# EAGLE design e-socks (EAGLE 6.4)

## Sheet 1 of 4
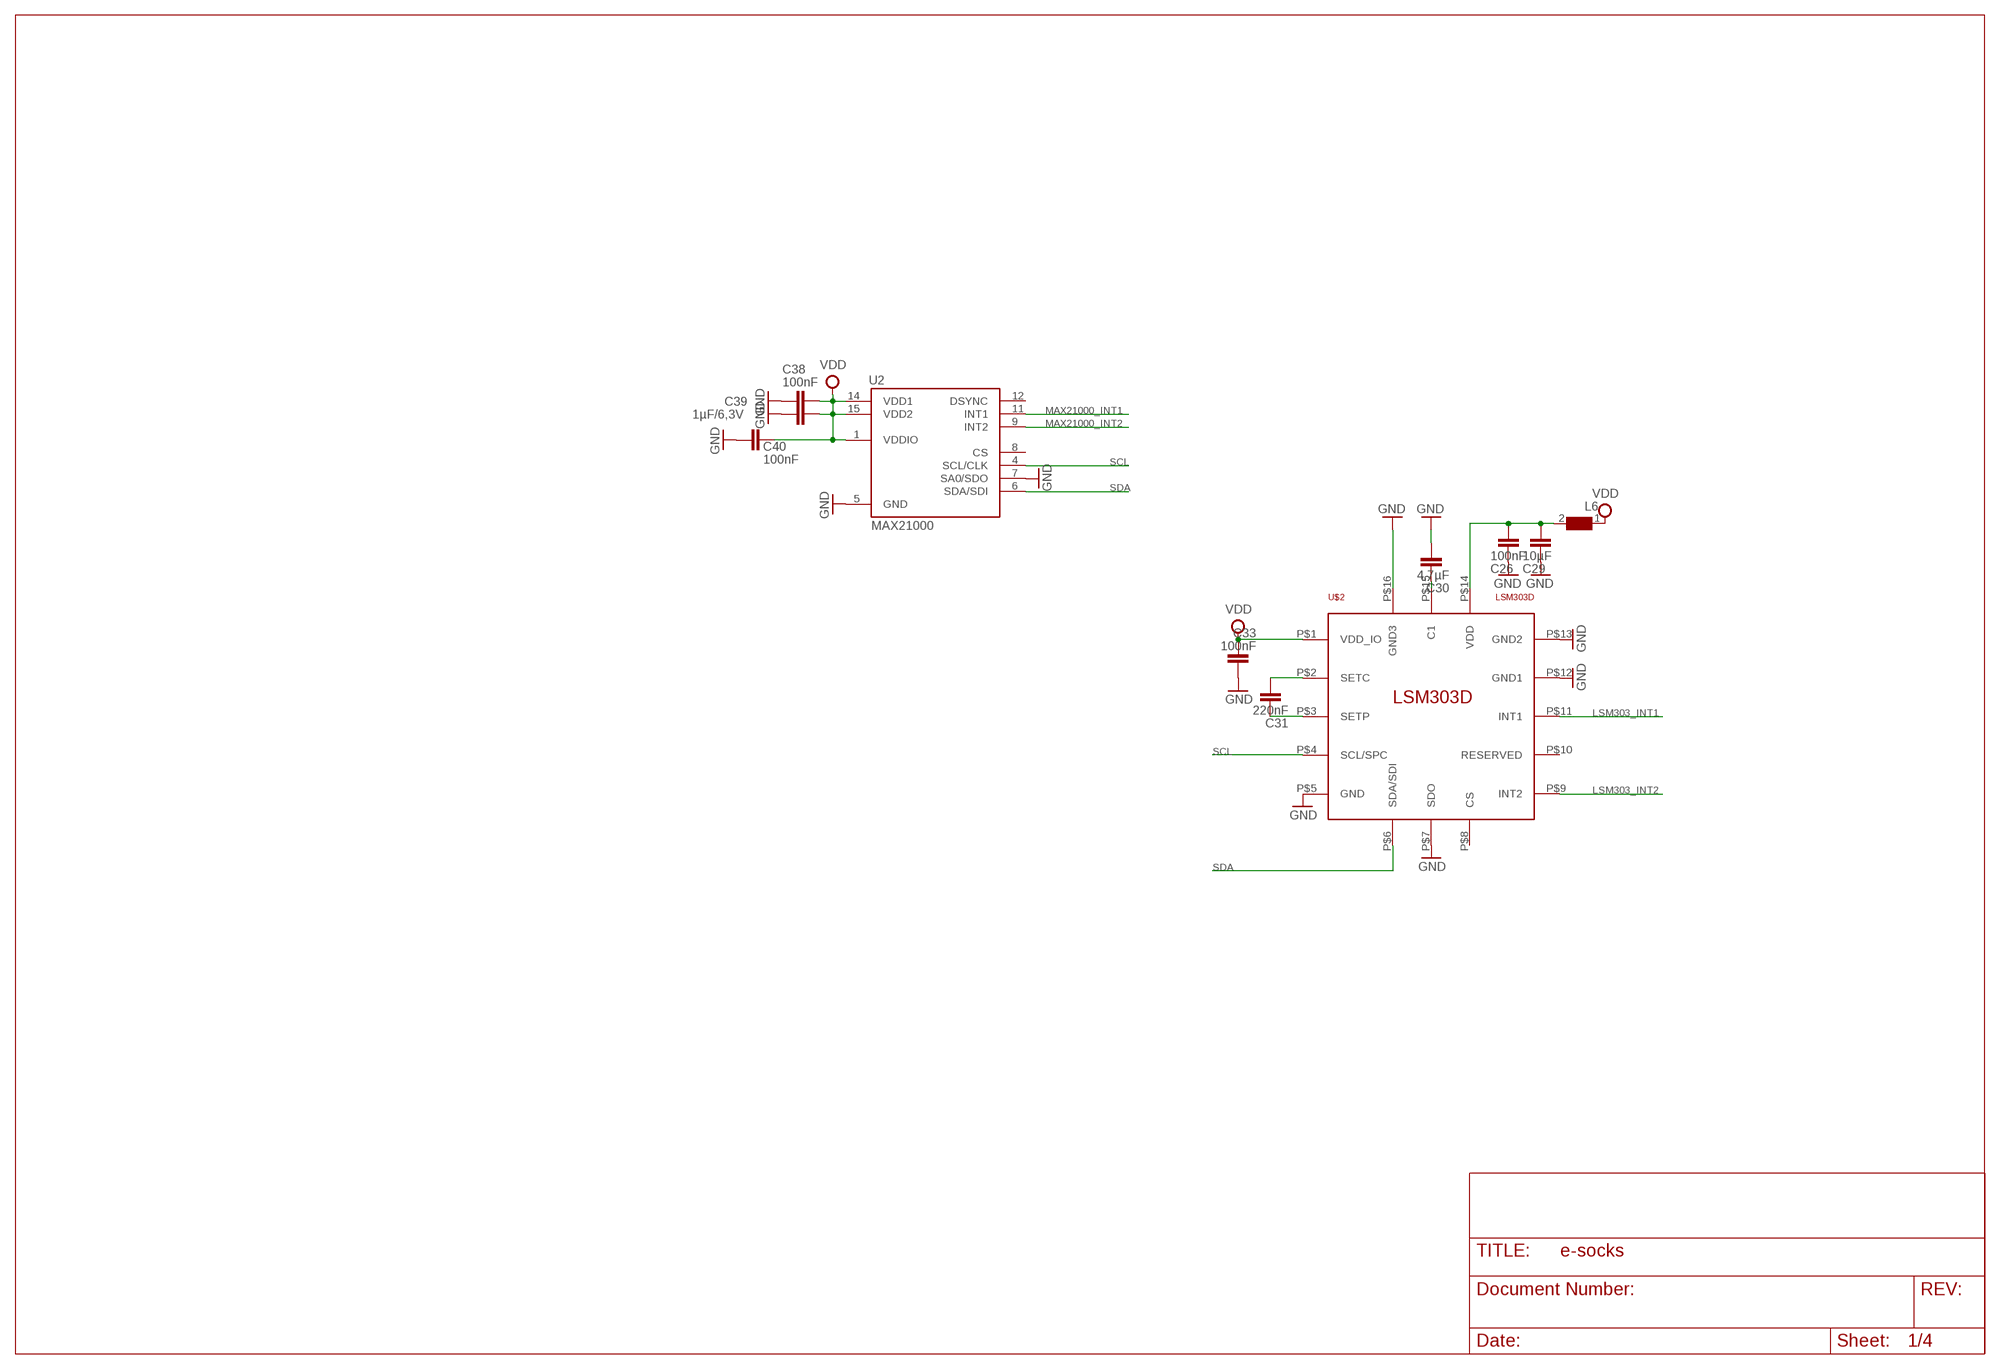
[diagram p0: schematic, sheet 1]

### Parts
C26  100nF  C-EUC0402  [C0402]
C29  10µF  C-EUC0402  [C0402]
C30  4,7µF  C-EUC0402  [C0402]
C31  220nF  C-EUC0402  [C0402]
C33  100nF  C-EUC0402  [C0402]
C38  100nF  C-EUC0402  [C0402]
C39  1µF/6,3V  C-EUC0402  [C0402]
C40  100nF  C-EUC0402  [C0402]
L6  WE-CBF_0402  [0402]
U2  MAX21000  [16LGA]
U$2  LSM303D  [TFLGA16L]

### Nets
GND: C26.2 C29.2 C30.1 C33.1 C38.2 C39.2 C40.2 U2.5(GND) U2.7(SA0/SDO) U$2.P$5(GND) U$2.P$7(SDO) U$2.P$12(GND1) U$2.P$13(GND2) U$2.P$16(GND3) ; also sheet 2,3,4
LSM303_INT1: U$2.P$11(INT1) ; also sheet 3
LSM303_INT2: U$2.P$9(INT2)
MAX21000_INT1: U2.11(INT1) ; also sheet 3
MAX21000_INT2: U2.9(INT2)
N$27: C26.1 C29.1 L6.2 U$2.P$14(VDD)
N$30: C31.1 U$2.P$2(SETC)
N$31: C31.2 U$2.P$3(SETP)
N$37: C30.2 U$2.P$15(C1)
SCL: U2.4(SCL/CLK) U$2.P$4(SCL/SPC) ; also sheet 3
SDA: U2.6(SDA/SDI) U$2.P$6(SDA/SDI) ; also sheet 3
VDD: C33.2 C38.1 C39.1 C40.1 L6.1 U2.1(VDDIO) U2.14(VDD1) U2.15(VDD2) U$2.P$1(VDD_IO) ; also sheet 2,3
Unconnected: U2.8(CS) U2.12(DSYNC) U$2.P$8(CS) U$2.P$10(RESERVED)

## Sheet 2 of 4
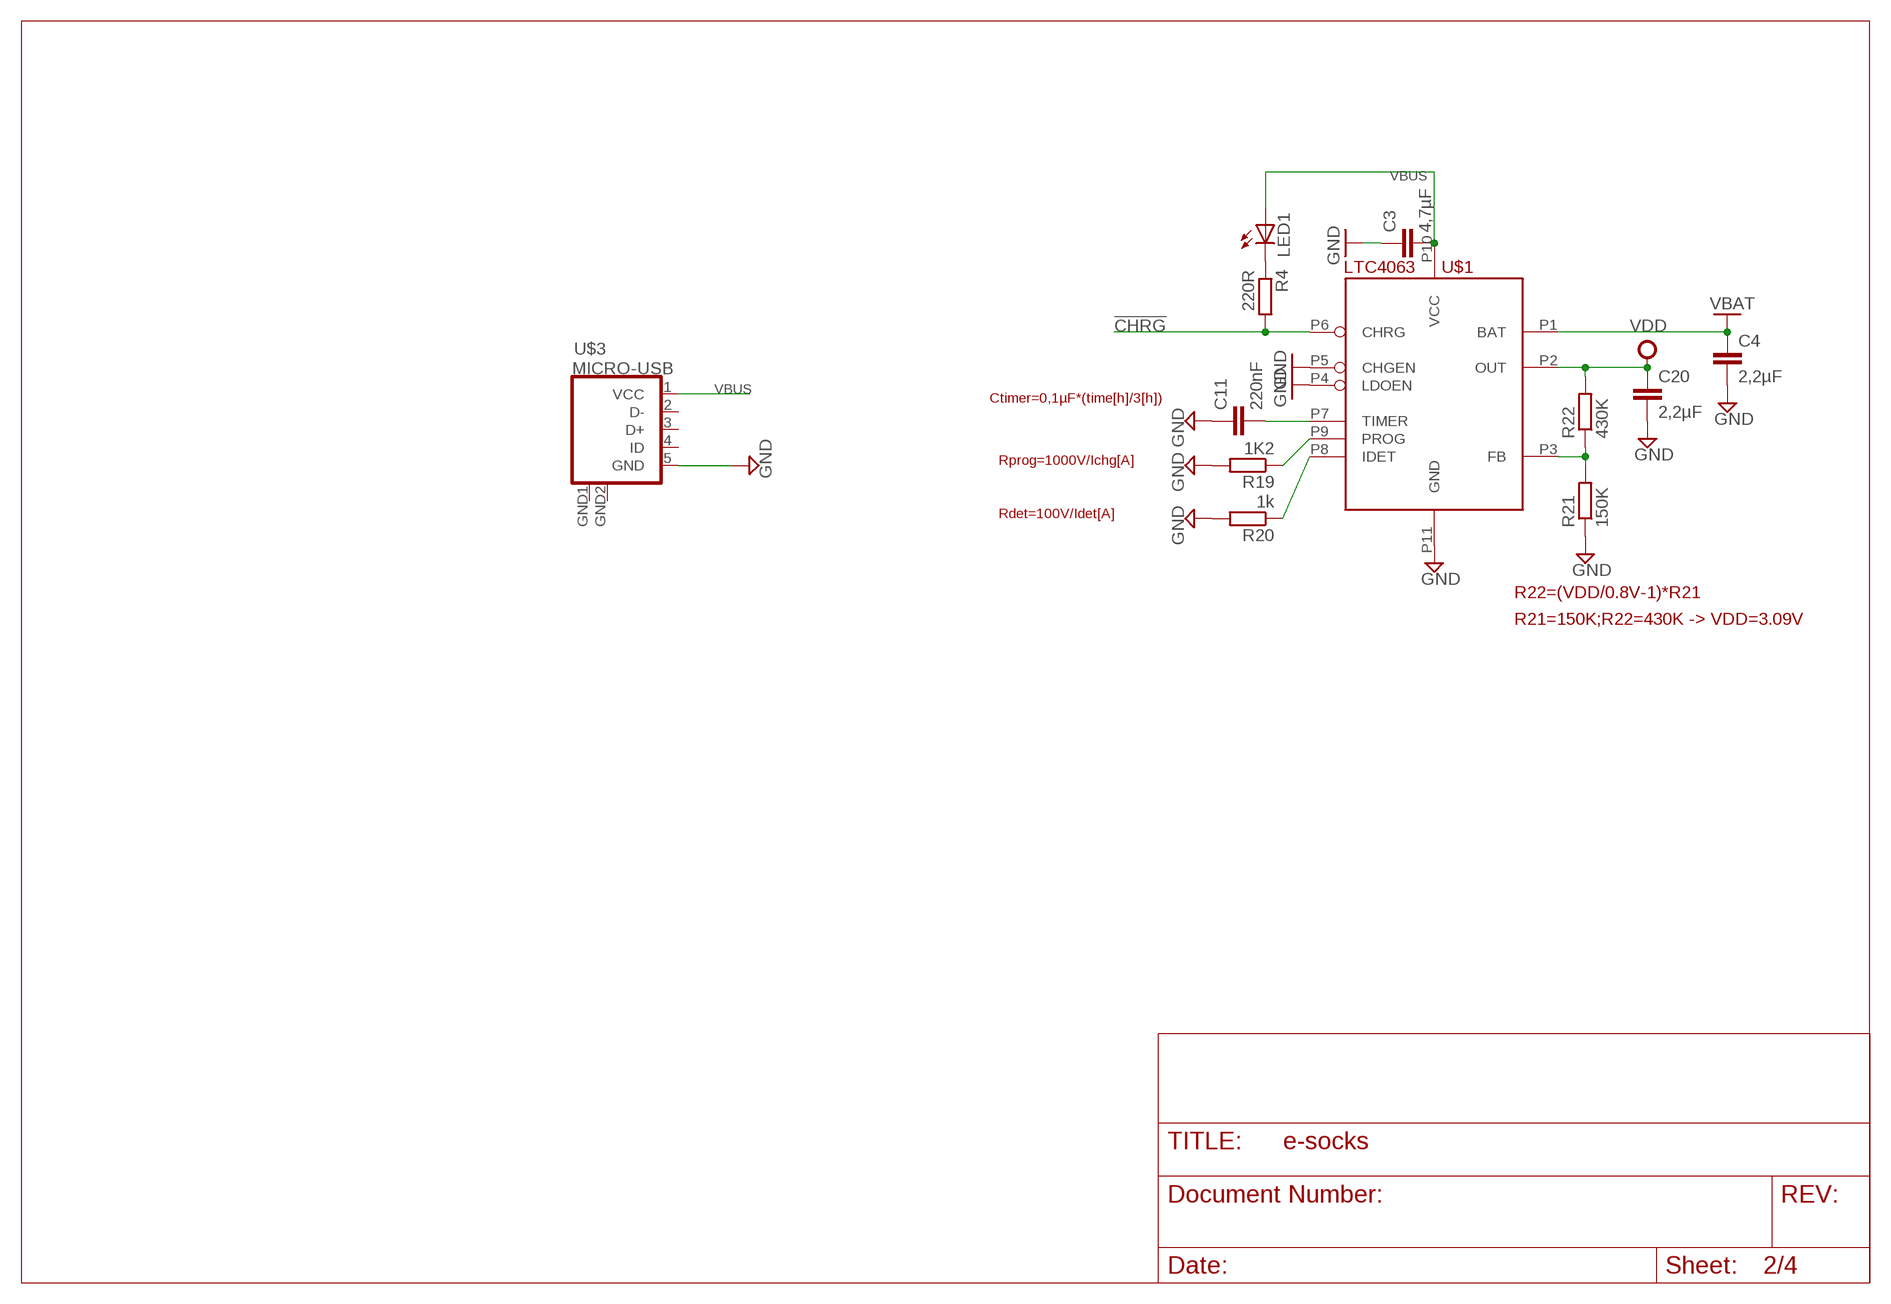
[diagram p1: schematic, sheet 2]

### Parts
C3  4,7µF  C-EUC0402  [C0402]
C4  2,2µF  C-EUC0402  [C0402]
C11  220nF  C-EUC0402  [C0402]
C20  2,2µF  C-EUC0402  [C0402]
LED1  LEDCHIP-LED0603  [CHIP-LED0603]
R4  220R  R-EU_R0402  [R0402]
R19  1K2  R-EU_R0402  [R0402]
R20  1k  R-EU_R0402  [R0402]
R21  150K  R-EU_R0402  [R0402]
R22  430K  R-EU_R0402  [R0402]
U$1  LTC4063  [LTC4063]
U$3  MICRO-USB  [MICRO-USB]

### Nets
!CHRG: R4.2 U$1.P6(CHRG) ; also sheet 3
GND: C3.1 C4.2 C11.1 C20.2 R19.2 R20.2 R21.1 U$1.P4(LDOEN) U$1.P5(CHGEN) U$1.P11(GND) U$3.5(GND) ; also sheet 1,3,4
N$8: C11.2 U$1.P7(TIMER)
N$9: R20.1 U$1.P8(IDET)
N$11: R21.2 R22.1 U$1.P3(FB)
N$20: R19.1 U$1.P9(PROG)
N$26: LED1.C R4.1
VBAT: C4.1 U$1.P1(BAT) ; also sheet 3,4
VBUS: C3.2 LED1.A U$1.P10(VCC) U$3.1(VCC)
VDD: C20.1 R22.2 U$1.P2(OUT) ; also sheet 1,3
Unconnected: U$3.2(D-) U$3.3(D+) U$3.4(ID)

### Notes on the sheet
- Ctimer=0,1µF*(time[h]/3[h])
- Rprog=1000V/Ichg[A]
- Rdet=100V/Idet[A]
- R22=(VDD/0.8V-1)*R21
- R21=150K;R22=430K -> VDD=3.09V

## Sheet 3 of 4
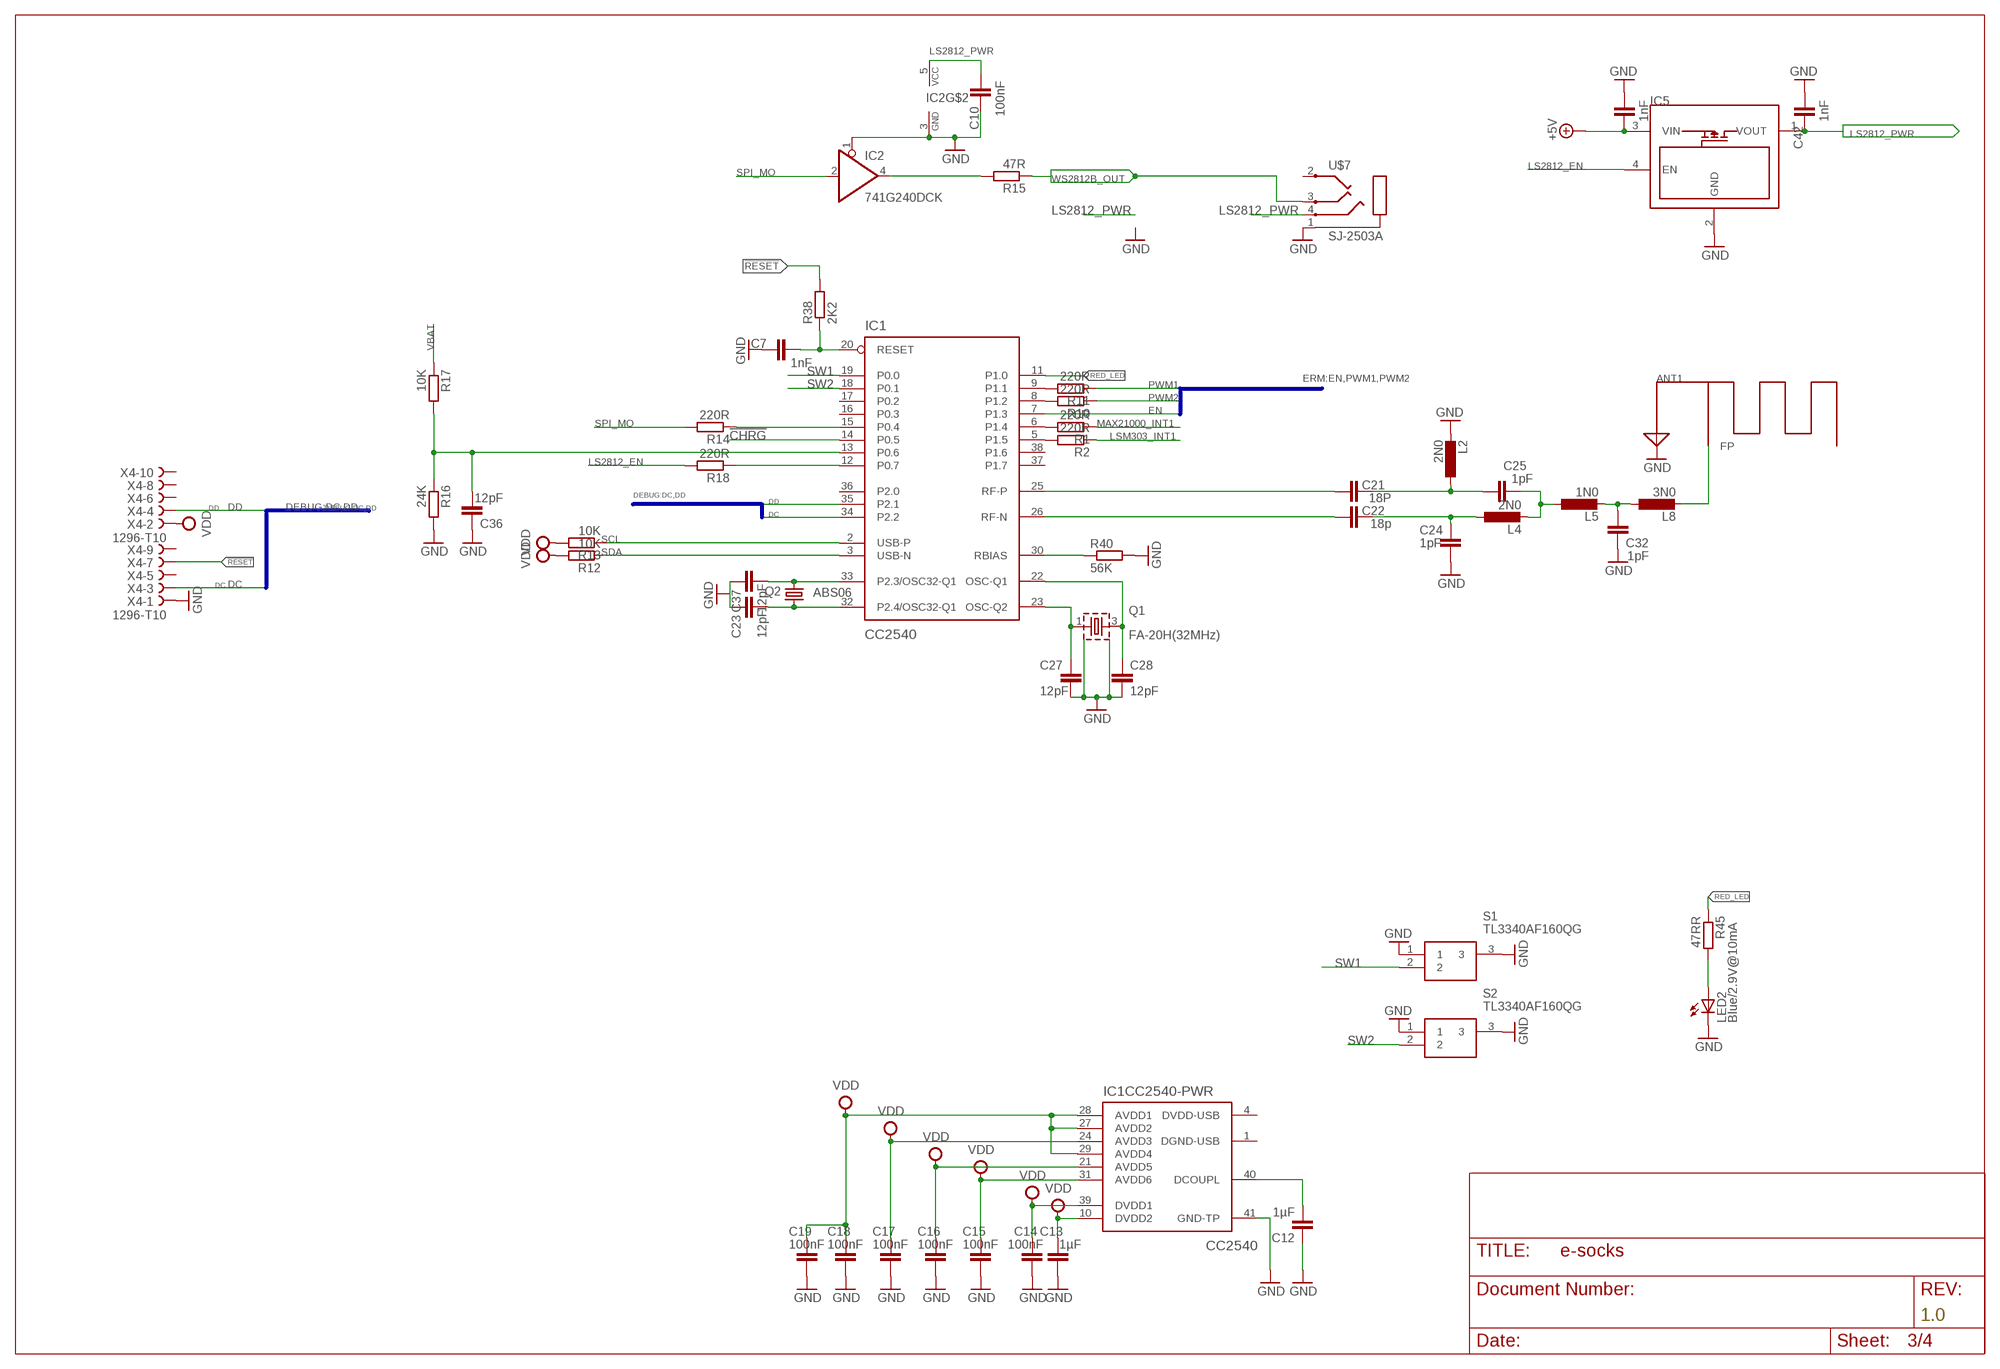
[diagram p2: schematic, sheet 3]

### Parts
ANT1  MIFA  [MIFA]
C7  1nF  C-EUC0402  [C0402]
C10  100nF  C-EUC0402  [C0402]
C12  1µF  C-EUC0402  [C0402]
C13  1µF  C-EUC0402  [C0402]
C14  100nF  C-EUC0402  [C0402]
C15  100nF  C-EUC0402  [C0402]
C16  100nF  C-EUC0402  [C0402]
C17  100nF  C-EUC0402  [C0402]
C18  100nF  C-EUC0402  [C0402]
C19  100nF  C-EUC0402  [C0402]
C21  18P  C-EUC0402  [C0402]
C22  18p  C-EUC0402  [C0402]
C23  12pF  C-EUC0402  [C0402]
C24  1pF  C-EUC0402  [C0402]
C25  1pF  C-EUC0402  [C0402]
C27  12pF  C-EUC0402  [C0402]
C28  12pF  C-EUC0402  [C0402]
C32  1pF  C-EUC0402  [C0402]
C36  12pF  C-EUC0402  [C0402]
C37  12pF  C-EUC0402  [C0402]
C41  1nF  C-EUC0402  [C0402]
C42  1nF  C-EUC0402  [C0402]
IC1  CC2540  [QFN50P600X600X100-41N]
IC2  741G240DCK  [SC70-5]
IC5  MIC94040  [MIC94040]
L2  2N0  L-EUL0402  [L0402]
L4  2N0  L-EUL0402  [L0402]
L5  1N0  L-EUL0402  [L0402]
L8  3N0  L-EUL0402  [L0402]
LED2  Blue/2.9V@10mA  LEDCHIP-LED0603  [CHIP-LED0603]
Q1  FA-20H(32MHz)  FA-20H  [FA-20H]
Q2  ABS06  [ABS06]
R1  220R  R-EU_R0402  [R0402]
R2  220R  R-EU_R0402  [R0402]
R10  220R  R-EU_R0402  [R0402]
R11  220R  R-EU_R0402  [R0402]
R12  10K  R-EU_R0402  [R0402]
R13  10K  R-EU_R0402  [R0402]
R14  220R  R-EU_R0402  [R0402]
R15  47R  R-EU_R0402  [R0402]
R16  24K  R-EU_R0402  [R0402]
R17  10K  R-EU_R0402  [R0402]
R18  220R  R-EU_R0402  [R0402]
R38  2K2  R-EU_R0402  [R0402]
R40  56K  R-EU_R0402  [R0402]
R45  47RR  R-EU_R0402  [R0402]
S1  TL3340AF160QG  [TL3340]
S2  TL3340AF160QG  [TL3340]
U$7  SJ-2503A  [SJ-2503]
X4  1296-T10  [1296-10]

### Nets
!CHRG: IC1.14(P0.5) ; also sheet 2
!RESET: R38.2 X4.7
!RESET_INTERN: C7.2 IC1.20(RESET) R38.1
+5V: C41.1 IC5.3(VIN) ; also sheet 4
DC: IC1.34(P2.2) X4.3
DD: IC1.35(P2.1) X4.4
EN: IC1.7(P1.3) ; also sheet 4
GND: ANT1.ANT_GND C7.1 C10.1 C12.1 C13.1 C14.1 C15.1 C16.1 C17.1 C18.1 C19.1 C23.1 C24.1 C27.2 C28.2 C32.2 C36.1 C37.1 C41.2 C42.2 IC1.41(GND-TP) IC2.1(OE) IC2.3(GND) IC5.2(GND) L2.2 LED2.C Q1.2(S1) Q1.4(S2) R16.2 R40.2 S1.1 S1.3 S2.1 S2.3 U$7.1 X4.1 ; also sheet 1,2,4
LS2812_EN: IC5.4(EN) R18.2
LS2812_PWR: C10.2 C42.1 IC2.5(VCC) IC5.1(VOUT) U$7.4
LSM303_INT1: R1.1 ; also sheet 1
MAX21000_INT1: R2.1 ; also sheet 1
N$15: IC1.6(P1.4) R1.2
N$18: IC1.5(P1.5) R2.2
N$28: C12.2 IC1.40(DCOUPL)
N$29: IC1.8(P1.2) R10.2
N$32: LED2.A R45.2
N$34: IC1.30(RBIAS) R40.1
N$35: C21.2 IC1.25(RF-P)
N$36: C22.2 IC1.26(RF-N)
N$38: C37.2 IC1.33(P2.3/OSC32-Q1) Q2.2
N$39: C23.2 IC1.32(P2.4/OSC32-Q1) Q2.1
N$40: IC1.9(P1.1) R11.2
N$41: C27.1 IC1.23(OSC-Q2) Q1.1(Q1)
N$42: C28.1 IC1.22(OSC-Q1) Q1.3(Q2)
N$44: IC2.4(O) R15.2
N$45: C21.1 C25.2 L2.1
N$46: C22.1 C24.2 L4.1
N$47: C25.1 L4.2 L5.1
N$48: C32.1 L5.2 L8.1
N$49: ANT1.FP L8.2
N$50: IC1.15(P0.4) R14.1
N$51: C36.2 IC1.13(P0.6) R16.1 R17.2
N$52: IC1.12(P0.7) R18.1
PWM1: R11.1 ; also sheet 4
PWM2: R10.1 ; also sheet 4
RED_LED: IC1.11(P1.0) R45.1
SCL: IC1.2(USB-P) R13.1 ; also sheet 1
SDA: IC1.3(USB-N) R12.1 ; also sheet 1
SPI_MO: IC2.2(I) R14.2
SW1: IC1.19(P0.0) S1.2
SW2: IC1.18(P0.1) S2.2
VBAT: R17.1 ; also sheet 2,4
VDD: C13.2 C14.2 C15.2 C16.2 C17.2 C18.2 C19.2 IC1.10(DVDD2) IC1.21(AVDD5) IC1.24(AVDD3) IC1.27(AVDD2) IC1.28(AVDD1) IC1.29(AVDD4) IC1.31(AVDD6) IC1.39(DVDD1) R12.2 R13.2 X4.2 ; also sheet 1,2
WS2812B_OUT: R15.1 U$7.3
Unconnected: IC1.16(P0.3) IC1.17(P0.2) IC1.36(P2.0) IC1.37(P1.7) IC1.38(P1.6) U$7.2 X4.5 X4.6 X4.8 X4.9 X4.10

### Buses
DEBUG:DC,DD
ERM:EN,PWM1,PWM2

### Notes on the sheet
- 1.0

## Sheet 4 of 4
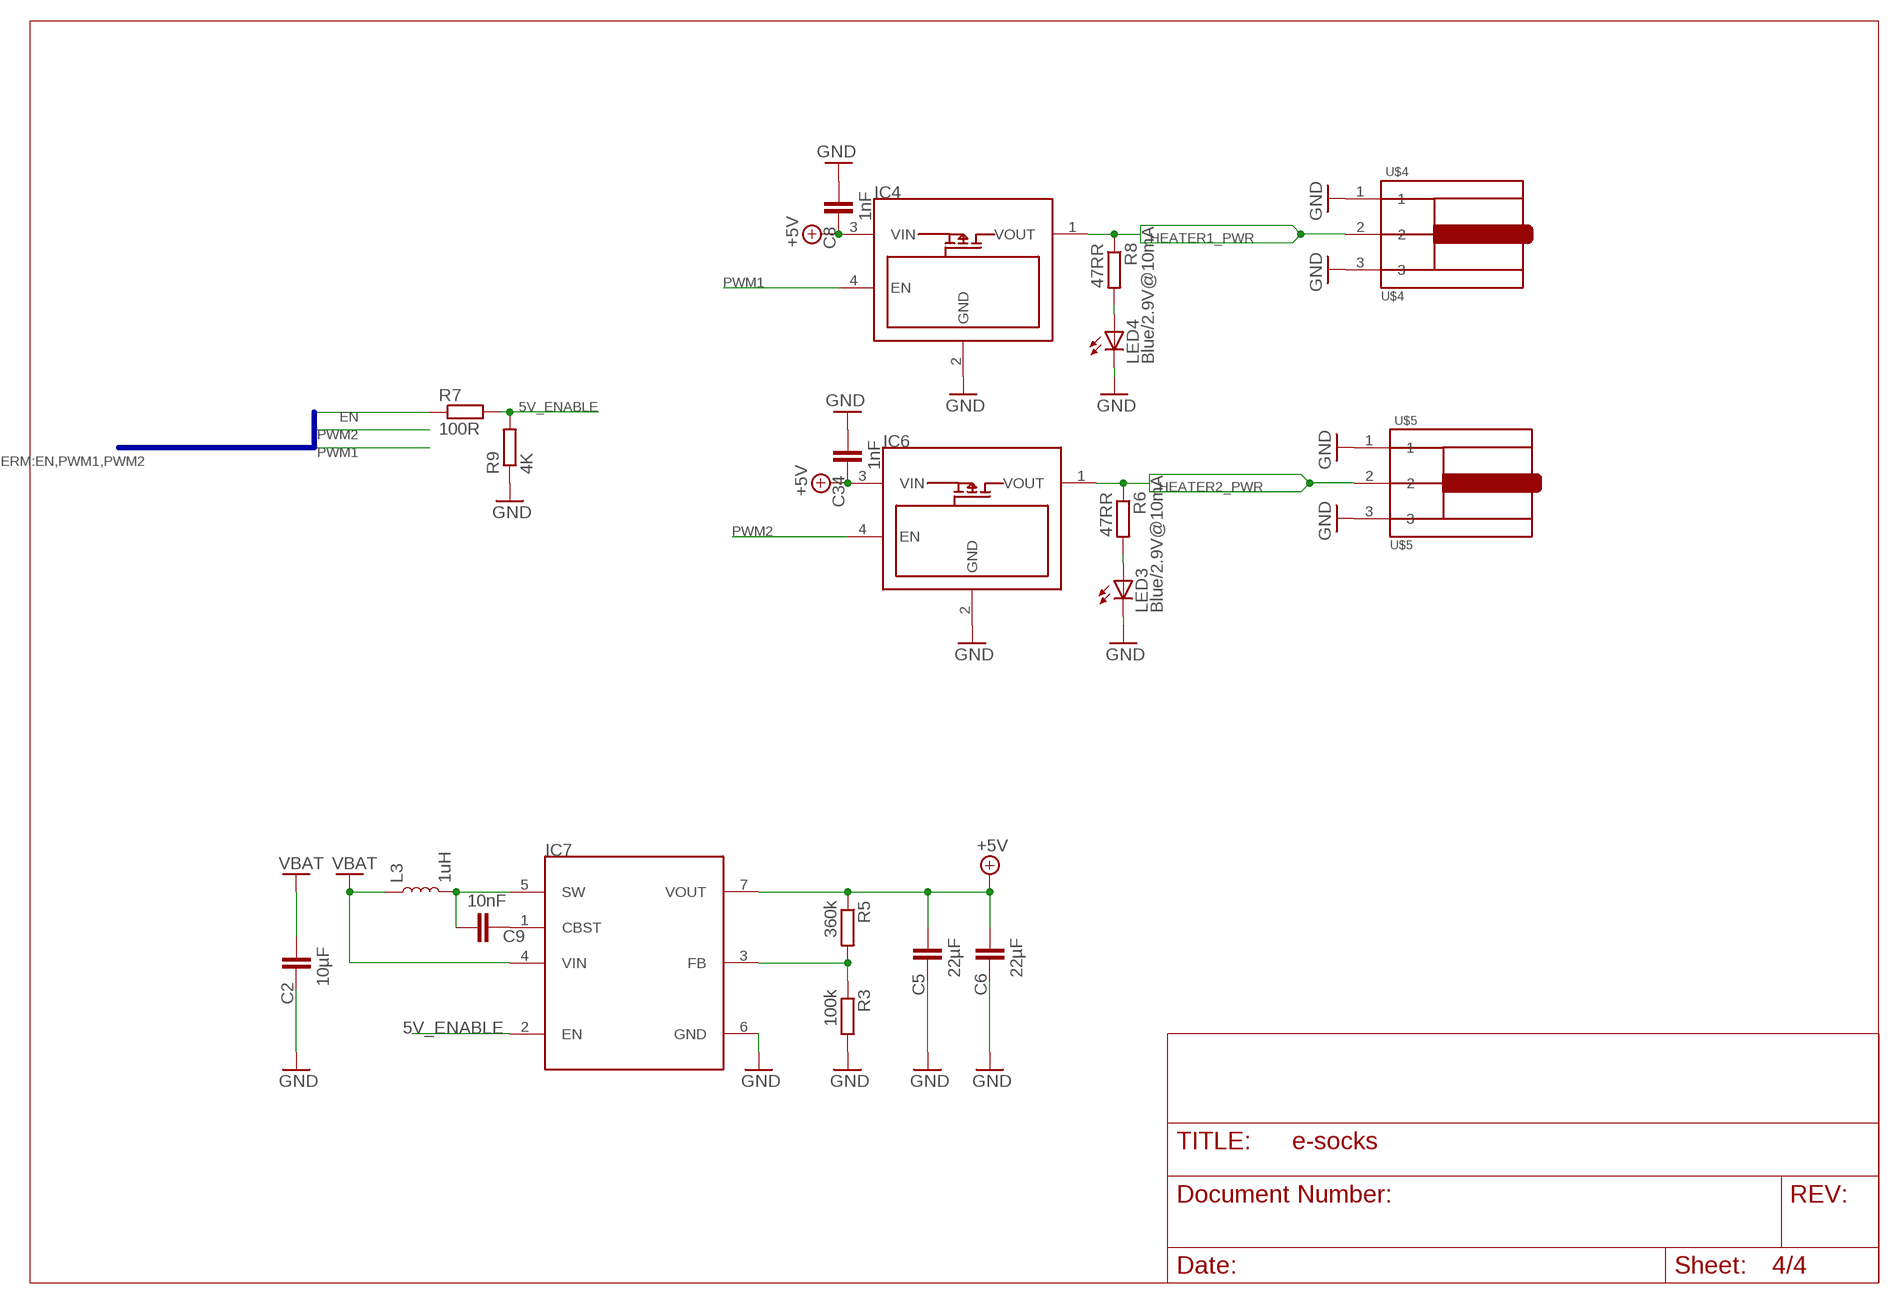
[diagram p3: schematic, sheet 4]

### Parts
C2  10µF  C-EUC0603  [C0603]
C5  22µF  C-EUC0805  [C0805]
C6  22µF  C-EUC0805  [C0805]
C8  1nF  C-EUC0402  [C0402]
C9  10nF  C-EUC0402  [C0402]
C34  1nF  C-EUC0402  [C0402]
IC4  MIC94040  [MIC94040]
IC6  MIC94040  [MIC94040]
IC7  TPS61230AVQFN  [VQFN]
L3  1uH  INDUCTOR-XFL40201.5UH  [XFL4020]
LED3  Blue/2.9V@10mA  LEDCHIP-LED0603  [CHIP-LED0603]
LED4  Blue/2.9V@10mA  LEDCHIP-LED0603  [CHIP-LED0603]
R3  100k  R-EU_R0402  [R0402]
R5  360k  R-EU_R0402  [R0402]
R6  47RR  R-EU_R0402  [R0402]
R7  100R  R-EU_R0402  [R0402]
R8  47RR  R-EU_R0402  [R0402]
R9  4K  R-EU_R0402  [R0402]
U$4  JACKJACK  [JACK]
U$5  JACKJACK  [JACK]

### Nets
5V_ENABLE: IC7.2(EN) R7.2 R9.2
+5V: C5.2 C6.2 C8.1 C34.1 IC4.3(VIN) IC6.3(VIN) IC7.7(VOUT) R5.1 ; also sheet 3
EN: R7.1 ; also sheet 3
GND: C2.1 C5.1 C6.1 C8.2 C34.2 IC4.2(GND) IC6.2(GND) IC7.6(GND) LED3.C LED4.C R3.2 R9.1 U$4.1 U$4.3 U$5.1 U$5.3 ; also sheet 1,2,3
HEATER1_PWR: IC4.1(VOUT) R8.1 U$4.2
HEATER2_PWR: IC6.1(VOUT) R6.1 U$5.2
N$1: LED3.A R6.2
N$3: LED4.A R8.2
N$4: IC7.3(FB) R3.1 R5.2
N$5: C9.2 IC7.5(SW) L3.P$2
N$6: C9.1 IC7.1(CBST)
PWM1: IC4.4(EN) ; also sheet 3
PWM2: IC6.4(EN) ; also sheet 3
VBAT: C2.2 IC7.4(VIN) L3.P$1 ; also sheet 2,3

### Buses
ERM:EN,PWM1,PWM2

## Power pins joined to a net without a drawn wire
DGND-USB: IC1.1(DGND-USB)
DVDD-USB: IC1.4(DVDD-USB)
GND: U$3.GND1(GND) U$3.GND2(GND)

## Library data of the parts
ANT1 = MIFA:MIFA: Meandered Inverted-F Antenna
C2 C3 C5-C19 C21-C34 C36-C42 = rcl:C-EU: CAPACITOR, European symbol
C4 C20 = resistor:C-EU: CAPACITOR, European symbol
IC1 = chipcon-ti-v2:CC2540: 2.4-GHz Bluetooth® low energy System-on-Chip
IC2 = 74xx-little-de:74*1G240: Single Buffer/Driver With 3-State Outputs
IC4-IC6 = micrel:MIC94040: 28mΩ RDSON 3A High Side Load Switch
IC7 = TPS61230A:TPS61230A: TPS61230A
L2 L4 L5 L8 = rcl-2:L-EU: INDUCTOR, European symbol
L3 = SparkFun-Coils:INDUCTOR-XFL4020; PROD_ID: INDUC-13855; VALUE: 1.5uH
L6 = wuerth_elektronik_v5:WE-CBF: SMD EMI Suppression Ferrite Beads - excellent anti-EMI properties - low DCR - impedances till 3000 ohms - rated current up to 6 A
LED1-LED4 = led:LED: LED OSRAM: - CHIPLED LG R971, LG N971, LY N971, LG Q971, LY Q971, LO R971, LY R971 LH N974, LH R974 LS Q976, LO Q976, LY Q976 LO Q996 - Hyper CHIPLED LW Q18S LB Q993, LB Q99A, LB R99A - SideLED LS A670, LO A670, LY A670, LG A670, LP A670 LB A673, LV A673, LT A673, LW A673 LH A674 LY A675 LS A676, LA A676, LO A676, LY A676, LW A676 LS A679, LY A679, LG A679 - Hyper Micro SIDELED® LS Y876, LA Y876, LO Y876, LY Y876 LT Y87S - SmartLED LW L88C, LW L88S LB L89C, LB L89S, LG L890 LS L89K, LO L89K, LY L89K LS L896, LA L896, LO L896, LY L896 - TOPLED LS T670, LO T670, LY T670, LG T670, LP T670 LSG T670, LSP T670, LSY T670, LOP T670, LYG T670 LG T671, LOG T671, LSG T671 LB T673, LV T673, LT T673, LW T673 LH T674 LS T676, LA T676, LO T676, LY T676, LB T676, LH T676, LSB T676, LW T676 LB T67C, LV T67C, LT T67C, LS T67K, LO T67K, LY T67K, LW E67C LS E67B, LA E67B, LO E67B, LY E67B, LB E67C, LV E67C, LT E67C LW T67C LS T679, LY T679, LG T679 LS T770, LO T770, LY T770, LG T770, LP T770 LB T773, LV T773, LT T773, LW T773 LH T774 LS E675, LA E675, LY E675, LS T675 LS T776, LA T776, LO T776, LY T776, LB T776 LHGB T686 LT T68C, LB T68C - Hyper Mini TOPLED® LB M676 - Mini TOPLED Santana® LG M470 LS M47K, LO M47K, LY M47K Source: http://www.osram.convergy.de LUXEON: - LUMILED® LXK2-PW12-R00, LXK2-PW12-S00, LXK2-PW14-U00, LXK2-PW14-V00 LXK2-PM12-R00, LXK2-PM12-S00, LXK2-PM14-U00 LXK2-PE12-Q00, LXK2-PE12-R00, LXK2-PE12-S00, LXK2-PE14-T00, LXK2-PE14-U00 LXK2-PB12-K00, LXK2-PB12-L00, LXK2-PB12-M00, LXK2-PB14-N00, LXK2-PB14-P00, LXK2-PB14-Q00 LXK2-PR12-L00, LXK2-PR12-M00, LXK2-PR14-Q00, LXK2-PR14-R00 LXK2-PD12-Q00, LXK2-PD12-R00, LXK2-PD12-S00 LXK2-PH12-R00, LXK2-PH12-S00 LXK2-PL12-P00, LXK2-PL12-Q00, LXK2-PL12-R00 Source: www.luxeon.com KINGBRIGHT: KA-3528ASYC Source: www.kingbright.com
Q1 = crystal-epson:FA-20H
Q2 = crystal:ABS06: 32.768kHz crystal
R1-R22 R38 R40 R45 = rcl:R-EU_: RESISTOR, European symbol
S1 S2 = SamacSys_Parts:TL3340AF160QG: E-SWITCH - TL3340AF160QG. - SWITCH, TACTILE SPST 50mA, SMD GULL WING Source: Datasheet <https://componentsearchengine.com/Datasheets/1/TL3340AF160QG.pdf>; DESCRIPTION: E-SWITCH - TL3340AF160QG. - SWITCH, TACTILE SPST 50mA, SMD GULL WING; HEIGHT: mm; MANUFACTURER_NAME: E-Switch; MANUFACTURER_PART_NUMBER: TL3340AF160QG; MOUSER_PART_NUMBER: 612-TL3340AF160QG
U2 = bt:MAX21000: MAX21000 MEMS Gyro The MAX21000 is a low power, low noise, 3-axis angular rate sensor that delivers unprecedented accuracy and sensitivity over temperature and time. It operates with a supply voltage as low as 1.71V for minimum power consumption. It includes a sensing element and an IC interface that provides the measured angular rate to the external world through a digital interface (I2C/SPI). Datasheet.pdf <http://datasheets.maximintegrated.com/en/ds/MAX21000.pdf>
U$1 = LinearTechnology:LTC4063: LTC4063 - Standalone Linear Li-Ion Charger with Micropower Low Dropout Linear Regulator The LTC®4063 is a standalone linear charger for single cell lithium-ion batteries with an adjustable low dropout linear regulator (LDO). The adjustable LDO regulates an output voltage between 1.2V to 4.2V at up to 100mA load cur- rent. When the input supply (wall adapter or USB supply) is removed, the LDO regulates the output voltage without interruption. The battery charger and LDO regulator can be enabled individually. No external sense resistor or external blocking diode is required for charging due to the internal MOSFET archi- tecture. For more details have a look at the data sheet <http://cds.linear.com/docs/en/datasheet/4063fc.pdf>. Copyright (c) 2013, Michael Hohl <http://www.michaelhohl.net>
U$2 = LSM303D:LSM303D
U$3 = microusb1:MICRO-USB: Micro USB B connector
U$4 U$5 = 3.6mm_jack:JACK
U$7 = con-cuistack:SJ-2503A
X4 = con-leotronics:1296-T10: 1.27mm SINGLE ROW FEMALE SOCKET Source: http://www.leotronics.co.uk/Conexcon/Data%20Sheets/sec.%20A/1296ing.pdf

## Board
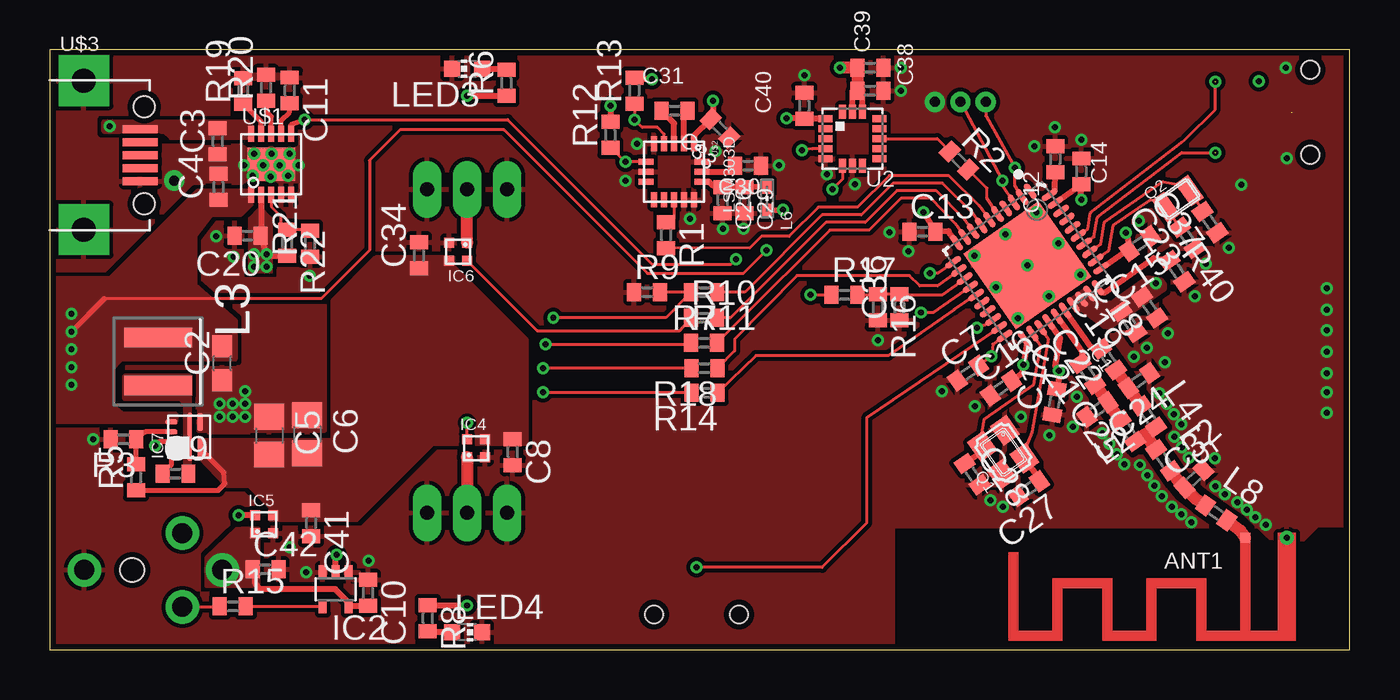
[diagram p4: board, top side]
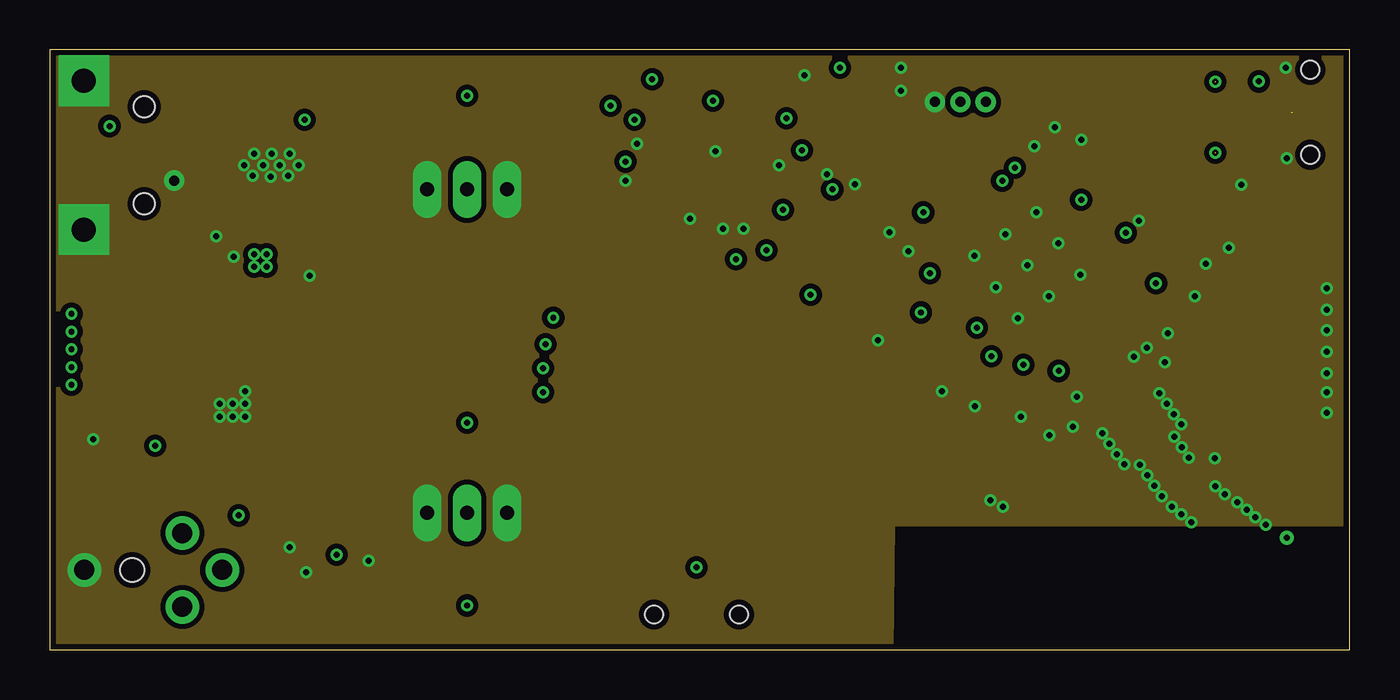
[diagram p5: board, inner layer Route2]
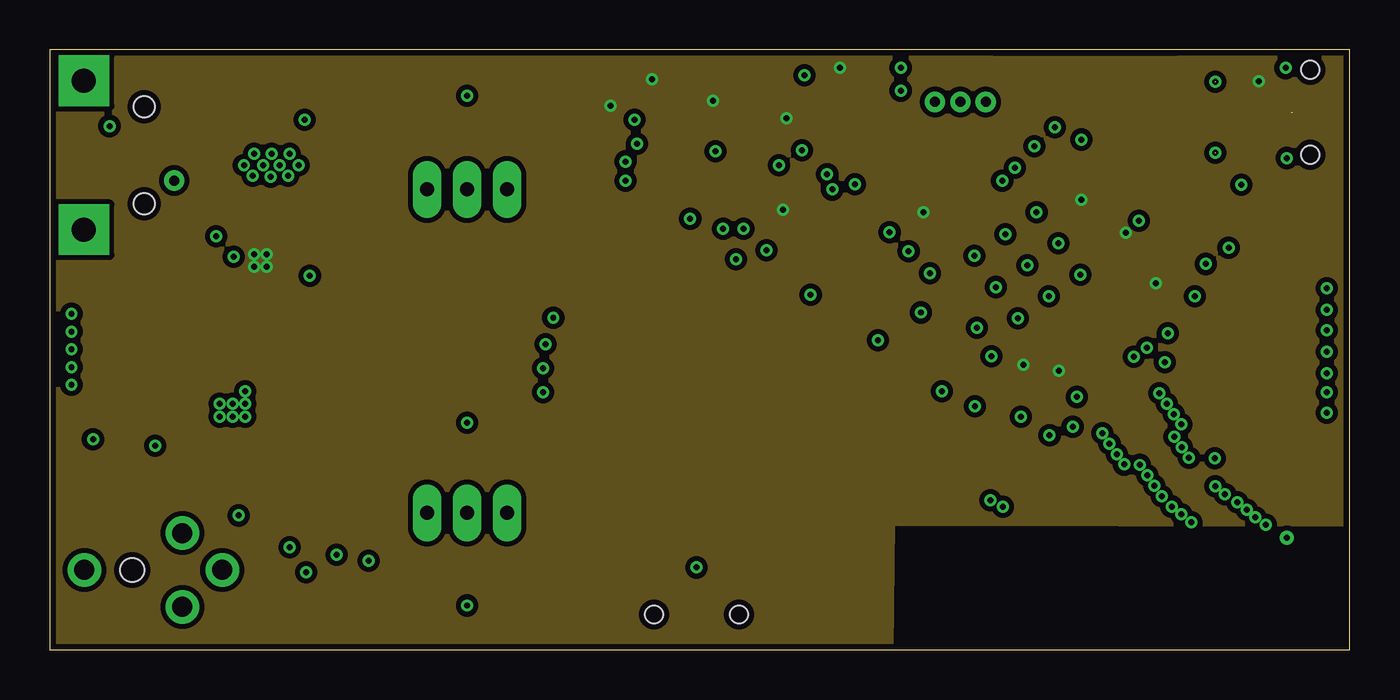
[diagram p6: board, inner layer Route15]
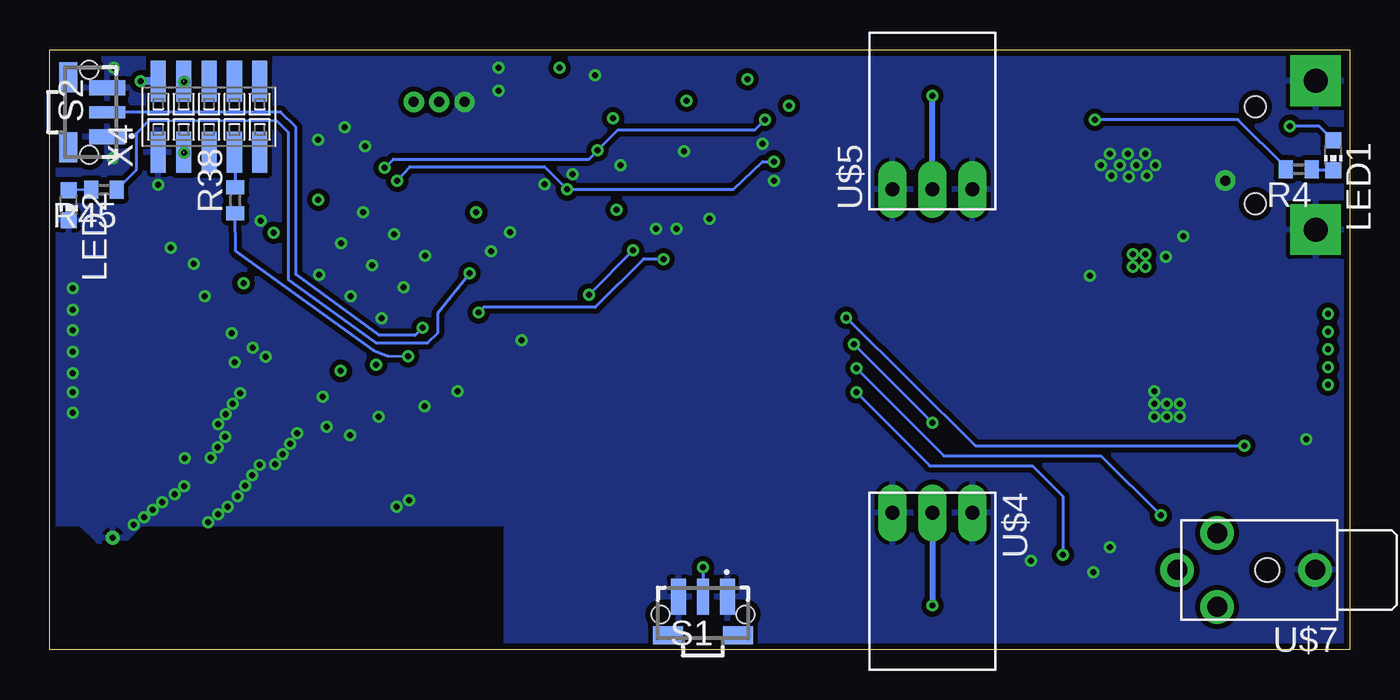
[diagram p7: board, bottom side, seen from below]

Size 65.09 x 30.04 mm. Coordinates in mm from the lower left corner, seen from the top.
Outline: 0,0 65.09,0 65.09,30.04 0,30.04 0,0
Copper layers (1+2*15+16): Top 0.035mm / dielectric 0.38mm / Route2 0.035mm / dielectric 0.75mm / Route15 0.035mm / dielectric 0.38mm / Bottom 0.035mm
Design rules "PCB-POOL Standard *": minimum track width 0.15mm, minimum drill 0.3mm, track to track 0.15mm, track to pad 0.15mm, pad to pad 0.15mm, via to via 0.15mm, smd to smd 0.15mm, copper to edge 0.3mm, drill to drill 0.2mm, minimum pad ring 0.2mm, minimum via ring 0.15mm, stop-mask expansion 0.075mm, vias tented up to drill 0mil, thermal gap 0.2mm
tRestrict: 14 lines

### Footprints (pad centres in the part's own frame; a part is rotated, then mirrored left to right if it is on the bottom)
MIFA = drill 0.3 pad 0.61: ANT_GND -2.1,0 | smd 0.5 x 0.5: FP 0,0
C0603 = smd 1.1 x 1: 1 -0.85,0; 2 0.85,0
C0402 = smd 0.7 x 0.9: 1 -0.65,0; 2 0.65,0
C0805 = smd 1.3 x 1.5: 1 -0.95,0; 2 0.95,0
QFN50P600X600X100-41N = smd 0.9 x 0.3: 1 -2.95,2.25; 2 -2.95,1.75; 3 -2.95,1.25; 4 -2.95,0.75; 5 -2.95,0.25; 6 -2.95,-0.25; 7 -2.95,-0.75; 8 -2.95,-1.25; 9 -2.95,-1.75; 10 -2.95,-2.25; 21 2.95,-2.25; 22 2.95,-1.75; 23 2.95,-1.25; 24 2.95,-0.75; 25 2.95,-0.25; 26 2.95,0.25; 27 2.95,0.75; 28 2.95,1.25; 29 2.95,1.75; 30 2.95,2.25 | smd 0.3 x 0.9: 11 -2.25,-2.95; 12 -1.75,-2.95; 13 -1.25,-2.95; 14 -0.75,-2.95; 15 -0.25,-2.95; 16 0.25,-2.95; 17 0.75,-2.95; 18 1.25,-2.95; 19 1.75,-2.95; 20 2.25,-2.95; 31 2.25,2.95; 32 1.75,2.95; 33 1.25,2.95; 34 0.75,2.95; 35 0.25,2.95; 36 -0.25,2.95; 37 -0.75,2.95; 38 -1.25,2.95; 39 -1.75,2.95; 40 -2.25,2.95 | smd 4.6 x 4.6: 41 0,0
SC70-5 = smd 0.4 x 0.7: 1 -0.65,-0.85; 2 0,-0.85; 3 0.65,-0.85; 4 0.65,0.85; 5 -0.65,0.85
MIC94040 = smd 0.5 x 0.5: 1 -0.45,-0.45; 2 0.45,-0.45; 3 0.45,0.45; 4 -0.45,0.45
VQFN = smd 0.25 x 0.6: 1 -0.75,0.9; 2 -0.25,0.9; 3 0.25,0.9; 4 0.75,0.9 | smd 2.4 x 0.25: 5 0,-0.015 | smd 0.9 x 0.3: 6 0.75,-0.54 | smd 1.2 x 0.3: 7 -0.6,-0.54
L0402 = smd 0.7 x 0.9: 1 -0.65,0; 2 0.65,0
XFL4020 = smd 0.98 x 3.4: P$1 1,1.8; P$2 3.4,1.8
0402 = smd 0.7 x 0.6: 1 -0.6,0; 2 0.6,0
CHIP-LED0603 = smd 0.8 x 0.8: A 0,-0.75; C 0,0.75
FA-20H = smd 1.2 x 1: 1 -0.85,-0.7; 2 0.85,-0.7; 3 0.85,0.7; 4 -0.85,0.7
ABS06 = smd 0.75 x 1.4: 1 -0.725,0; 2 0.725,0
R0402 = smd 0.7 x 0.9: 1 -0.65,0; 2 0.65,0
TL3340 = smd 0.75 x 1.8: 1 1.225,2.1; 3 -1.225,2.1 | smd 0.6 x 1.8: 2 0,2.1 | smd 1.5 x 0.9: 4 -1.75,0.15; 5 1.75,0.15 | hole 0.9: 2.125,1.2; -2.125,1.2
16LGA = smd 0.7 x 0.34: 1 -1.35,1; 2 -1.35,0.5; 3 -1.35,0; 4 -1.35,-0.5; 5 -1.35,-1; 9 1.35,-1; 10 1.35,-0.5; 11 1.35,0; 12 1.35,0.5; 13 1.35,1 | smd 0.34 x 0.7: 6 -0.5,-1.35; 7 0,-1.35; 8 0.5,-1.35; 14 0.5,1.35; 15 0,1.35; 16 -0.5,1.35
LTC4063 = smd 0.3 x 0.8: P1 -1,-1.525; P2 -0.5,-1.525; P3 0,-1.525; P4 0.5,-1.525; P5 1,-1.525; P6 1,1.525; P7 0.5,1.525; P8 0,1.525; P9 -0.5,1.525; P10 -1,1.525 | smd 2.38 x 1.65: P11 0,0
TFLGA16L = smd 0.75 x 0.3: P$1 -1.4,1; P$2 -1.4,0.5; P$3 -1.4,0; P$4 -1.4,-0.5; P$5 -1.4,-1; P$9 1.4,-1; P$10 1.4,-0.5; P$11 1.4,0; P$12 1.4,0.5; P$13 1.4,1 | smd 0.3 x 0.75: P$6 -0.5,-1.4; P$7 0,-1.4; P$8 0.5,-1.4; P$14 0.5,1.4; P$15 0,1.4; P$16 -0.5,1.4
MICRO-USB = smd 0.4 x 1.75: 1 -1.3,4.525; 2 -0.65,4.525; 3 0,4.525; 4 0.65,4.525; 5 1.3,4.525 | drill 1.2 pad 2.54 square: GND1 -3.725,1.7; GND2 3.725,1.7 | hole 1.05: -2.425,4.73; 2.425,4.73
JACK = drill 0.7 pad 1.422 long: 1 0,2; 2 0,0; 3 0,-2
SJ-2503 = drill 1 pad 1.676: 1 -2.4,0; 2 2.5,-1.85; 3 2.5,1.85; 4 4.5,0 | hole 1.2: 0,0
1296-10 = smd 0.76 x 2.05: 1 -2.54,-1.78; 2 -2.54,1.78; 3 -1.27,-1.78; 4 -1.27,1.78; 5 0,-1.78; 6 0,1.78; 7 1.27,-1.78; 8 1.27,1.78; 9 2.54,-1.78; 10 2.54,1.78

### Placement (x,y rotation side)
ANT1  59.85,5.61 180 top
C2  8.64,14.35 90 top
C3  8.4,25.46 90 top
C4  8.45,23.18 90 top
C5  10.99,10.73 270 top
C6  12.89,10.79 270 top
C7  45.98,13.86 35 top
C8  23.18,9.91 270 top
C9  6.29,8.83 0 top
C10  15.93,2.85 270 top
C11  12.02,28.01 270 top
C12  50.35,24.57 270 top
C13  43.69,20.94 0 top
C14  51.65,23.95 270 top
C15  54.58,20.34 215 top
C16  47.63,13.11 35 top
C17  50.31,12.41 80 top
C18  55.07,17.15 125 top
C19  54.03,16.42 125 top
C20  9.9,20.74 180 top
C21  51.98,13.82 125 top
C22  53.02,14.55 125 top
C23  56.97,20.63 125 top
C24  54.54,13.48 215 top
C25  53.98,10.96 125 top
C26  33.69,22.52 270 top
C27  49.02,8.07 215 top
C28  46.19,8.8 305 top
C29  34.78,22.51 270 top
C30  34.95,24.25 180 top
C31  31.28,27 180 top
C32  57.29,8.56 43 top
C33  33.56,26.11 135 top
C34  18.48,19.75 90 top
C36  42.55,17.14 90 top
C37  58.09,21.41 125 top
C38  41.08,28 0 top
C39  41.08,29.15 0 top
C40  37.78,27.24 90 top
C41  13.08,6.35 270 top
C42  10.79,4.03 0 top
IC1  48.94,19.26 305 top
IC2  14.32,3.03 180 top
IC4  21.34,10.1 0 top
IC5  10.73,6.29 0 top
IC6  20.45,19.94 180 top
IC7  6.99,10.67 90 top
L2  52.46,12.03 215 top
L3  3.62,16.64 270 top
L4  55.02,11.69 305 top
L5  55.77,9.5 305 top
L6  35.91,22.6 90 top
L8  58.4,6.86 325 top
LED1  0.83,24.77 180 bottom
LED2  64.14,22.26 180 bottom
LED3  20.89,29.08 90 top
LED4  20.89,0.89 270 top
Q1  47.75,9.89 125 top
Q2  56.48,22.57 35 top
R1  30.86,20.76 270 top
R2  45.53,24.5 315 top
R3  3.68,10.54 180 top
R4  2.56,24.06 180 bottom
R5  4.32,8.64 90 top
R6  22.86,28.38 90 top
R7  32.77,17.91 180 top
R8  18.92,1.59 270 top
R9  29.91,17.91 0 top
R10  32.75,16.62 0 top
R11  32.77,15.37 0 top
R12  28.07,25.78 90 top
R13  29.27,28 90 top
R14  32.78,12.87 180 top
R15  9.16,2.18 0 top
R16  41.47,17.14 270 top
R17  39.79,17.77 0 top
R18  32.77,14.1 180 top
R19  9.69,27.98 90 top
R20  10.82,28.14 90 top
R21  13.03,20.34 90 top
R22  11.89,20.38 270 top
R38  55.8,22.51 90 bottom
R40  56.44,18.97 305 top
R45  62.38,23.04 180 bottom
S1  32.38,0.57 0 bottom
S2  64.33,26.92 270 bottom
U2  40.2,25.59 0 top
U$1  11.08,24.3 0 top
U$2  31.26,23.95 270 top
U$3  0,24.77 270 top
U$4  20.89,6.86 270 bottom
U$5  20.89,23.05 90 bottom
U$7  4.13,4 180 bottom
X4  57.12,26.69 0 bottom

### Tracks (layer width: path | path; a pad name or v marks a point on that pad's centre or on a via)
5V_ENABLE  (via drill 0.3)
  Top 0.15: v25.21,16.64 30.85,16.64 R7.2 R9.2
  Top 0.254: IC7.2 5.46,10.42 v5.27,10.22
  Bottom 0.15: v25.21,16.64 18.73,10.22 v5.27,10.22
!CHRG  (via drill 0.3)  (1 unrouted)
  Top 0.15: 12.76,26.54 22.92,26.54 30.16,19.3 34.1,19.3 v34.35,19.56 | v43.62,16.89 44.26,16.89 IC1.14
  Top 0.254: U$1.P6 12.08,26.31 12.76,26.54
  Bottom 0.15: 3.21,24.16 5.59,26.54 12.76,26.54 | v34.35,19.56 35.37,19.56 37.78,17.14 43.37,17.14 v43.62,16.89
  Bottom 0.254: R4.2 3.21,24.16
!RESET
  Bottom 0.15: X4.7 55.8,24.86 R38.2
!RESET_INTERN  (via drill 0.3)
  Top 0.15: IC1.20 47.22,15.3 v47.15,14.71 C7.2
  Bottom 0.15: v47.15,14.71 48.2,14.73 48.9,14.99 55.77,19.96 R38.1
+5V
  Top 0.254: R5.1 8.43,7.99 8.76,8.32 8.7,8.89 IC7.7
  pour Top (no thermals): 19.18,10.35 23.88,10.35 23.88,10.35 23.88,15.49 20.19,19.18 20.19,19.62 16.32,19.62 14.16,17.46 14.16,10.48 7.49,10.48 7.49,9.65 8.83,8.26 9.97,8.26 11.05,7.18 11.05,6.54 15.37,6.54
DC  (via drill 0.3)  (1 unrouted)
  Top 0.15: IC1.34 52.28,20.68 52.46,21.66 56.03,24.38 56.68,24.89 v58.36,24.89
DD  (via drill 0.3)  (1 unrouted)
  Top 0.15: IC1.35 51.97,21.07 52.11,21.87 56.65,25.4 56.66,25.4 56.9,25.59 58.36,27.05 v58.36,28.45
EN
  Top 0.15: IC1.7 46.16,21.91 44.7,23.37 42.23,23.37 40.64,21.78 38.67,21.78 34.8,17.91 R7.1
GND  (via drill 0.3, 0.5 pad 1.02)
  other vias: 55.56,12.85 55.98,15.85 49.29,25.21 54.53,21.49 58.34,9.6 52.7,10.84 49.41,21.91 51.6,18.79 48.94,19.26 46.29,19.72 48.48,16.6 48.63,11.67 47.72,7.16 47.85,20.82 50.5,20.35 50.04,17.7 47.38,18.16 42.05,20.91 55.84,14.39 50.06,10.74 46.33,12.19 51.22,11.18 57.34,17.7 44.68,12.95 47.1,7.5 54.94,15.12 51.65,25.55 50.32,26.17 51.43,12.66 54.59,9.26 54.95,8.74 55.32,8.22 55.68,7.7 56.17,7.18 57.16,6.39 56.67,6.78 56.32,10.66 56.68,10.14 58.36,8.18 59.47,7.4 58.85,7.79 55.93,12.33 56.29,11.81 56.66,11.29 53.8,9.28 53.43,9.8 53.07,10.32 59.66,23.29 59.93,7.01 57.05,9.62 54.29,14.67 59.03,20.12 57.89,19.32 60.37,6.65 42.61,29.15 42.61,28 37.78,28.77 40.32,23.3 38.93,23.81 33.34,24.96 29.4,25.34 36.51,24.26 33.72,21.08 34.73,21.08 32.07,21.59 15.95,4.46 12,5.14 28.83,23.5 8.32,20.7 9.21,19.68 13.02,18.73 10.16,23.75 10.22,24.83 10.67,24.26 60.88,6.27 44.32,27.43 6.22,23.5 41.46,15.5 12.84,3.88 11.05,23.69 11.11,24.83 11.49,24.26 11.94,23.75 12,24.83 8.51,12.32 9.78,12.32 9.14,12.32 9.14,11.68 9.78,11.68 63.94,18.1 63.94,17.02 63.94,16 63.94,14.92 63.94,13.84 63.94,12.89 63.94,11.87 2.16,10.54 8.51,11.68 9.78,12.95 12.45,24.26 9.72,24.26 43.01,19.96 61.95,24.62 61.88,29.13
  pour Top (isolate 0.2, rank 3): 0.32,29.84 0.12,0.16 42.23,0.06 42.23,6.22 60.52,6.22 61.53,5.21 62.42,5.21 63.47,6.25 64.73,6.25 64.77,29.78
  pour Route2 (isolate 0.254, rank 2, no thermals): 64.71,29.65 64.71,6.32 42.16,6.29 42.1,0 0.13,0.1 0.32,29.72
  pour Bottom (isolate 0.254, rank 3): 42.23,6.35 42.23,0.06 0,0 0.44,29.59 64.83,29.78 64.83,6.35 63.56,6.35 62.67,5.46 61.4,5.46 60.52,6.35
  pour Top (isolate 0.254, no thermals): 8.06,23.5 12.64,23.5 12.64,25.15 8.45,25.15
  pour Top (isolate 0.254, no thermals): 7.05,23.5 12.64,23.5 12.64,25.15 7.05,25.15
  pour Top (isolate 0.254, no thermals): 27.11,5.4 26.16,5.4 26.16,6.67 27.11,6.67
  pour Top (no thermals): 7.49,14.16 13.78,14.16 13.78,10.92 7.43,10.92
HEATER1_PWR  (via drill 0.3)
  Top 0.305: v20.89,2.22 18.94,2.22 R8.1
  Top 0.6: IC4.1 U$4.2
  Bottom 0.305: U$4.2 v20.89,2.22
HEATER2_PWR  (via drill 0.3)
  Top 0.305: v20.89,27.75 22.84,27.75 R6.1
  Top 0.6: IC6.1 U$5.2
  Bottom 0.305: U$5.2 v20.89,27.75
LS2812_EN  (via drill 0.3)
  Top 0.15: R18.2 v24.71,14.11 v24.7,14.1
  Top 0.305: IC5.4 v9.47,6.74 v9.46,6.73
  Bottom 0.15: v24.7,14.1 20.32,9.72 12.45,9.72 v9.46,6.73
LS2812_PWR
  Top 0.305: C10.2 14.99,2.2 IC2.5 14.97,2.37 14.29,3.05 10.54,3.05 10.29,3.3 10.29,3.88 C42.1
  pour Top (isolate 0.254, no thermals): 7.81,3.17 10.48,3.17 10.48,6.1 9.33,6.1 7.81,4.64
LSM303_INT1
  Top 0.15: U$2.P$11 31.26,21.62 R1.1
MAX21000_INT1
  Top 0.15: U2.11 44.44,25.59 R2.1
N$1
  Top 0.305: LED3.A 22.81,29.08 R6.2
N$2  (via drill 0.3)
  other vias: 12.76,26.54
N$3
  Top 0.305: LED4.A 18.97,0.89 R8.2
N$4
  Top 0.254: IC7.3 4.77,10.92 R3.1 4.33,9.36 R5.2
N$5
  pour Top (no thermals): 3.75,13.72 6.99,13.72 6.99,8.7 6.79,8.7 6.79,12.32 6.54,12.57 3.75,12.57
N$6
  Top 0.254: IC7.1 6.08,9.28 C9.1
N$8
  Top 0.15: 12,27.34 C11.2
  Top 0.254: U$1.P7 11.58,26.51 12,26.92 12,27.34
N$9
  Top 0.15: 10.86,27.32 R20.1
  Top 0.254: U$1.P8 11.08,26.7 10.86,26.92 10.86,27.32
N$11
  Top 0.15: U$1.P3 11.08,22.19 11.56,21.72 11.56,21.12 11.64,21.03 R22.1 12.99,21.03 R21.2
N$15
  Top 0.15: IC1.6 46.55,22.23 45.02,23.75 42.04,23.75 40.45,22.16 38.48,22.16 37.02,20.7 35.62,20.7 35.05,20.13 R1.2
N$18
  Top 0.15: IC1.5 46.93,22.61 46.93,23.11 R2.2
N$20
  Top 0.254: U$1.P9 10.58,26.43 R19.1
N$26
  Bottom 0.15: LED1.C 1.86,24.02
  Bottom 0.254: 1.86,24.02 R4.1
N$27
  Top 0.305: U$2.P$14 33.01,23.45 33.21,23.24 33.62,23.24 C26.1 34.76,23.17 C29.1 L6.2
N$28
  Top 0.305: IC1.40 50.32,22.99 C12.2
N$29
  Top 0.15: IC1.8 45.78,21.59 44.39,22.99 42.42,22.99 40.83,21.4 38.86,21.4 34.08,16.62 R10.2
N$30
  Top 0.305: U$2.P$2 31.76,26.96 C31.1
N$31
  Top 0.305: U$2.P$3 31.26,26.36 C31.2
N$32
  Bottom 0.15: R45.2 LED2.A
N$34
  Top 0.305: IC1.30 52.62,17.92 52.81,17.89 55.27,19.61 R40.1
N$35
  Top 0.305: IC1.25 51.7,14.89 C21.2
N$36
  Top 0.305: IC1.26 52.11,15.18 C22.2
N$37
  Top 0.305: U$2.P$15 34.3,23.95 C30.2
N$38
  Top 0.15: IC1.33 52.62,20.31 52.82,21.41 55.74,23.44 56.45,23.31 56.62,23.07 Q2.2 57.73,22.04 C37.2
N$39
  Top 0.15: IC1.32 53.02,19.98 53.24,21.25 55.13,22.54 55.66,22.45 55.86,22.16 Q2.1 56.58,21.16 C23.2
N$40
  Top 0.15: IC1.9 45.34,21.34 44.13,22.61 42.61,22.61 41.02,21.02 39.05,21.02 34.48,16.45 R11.2
N$41
  Top 0.15: IC1.23 50,15.57 49.18,10.89 48.94,10.34 Q1.1
  Top 0.305: Q1.1 49.57,8.52 C27.1
N$42
  Top 0.15: IC1.22 49.61,15.26 49.26,13.28 46.79,11.54 46.63,10.66 46.7,10.28
  Top 0.305: 46.7,10.28 Q1.3 46.64,9.91 C28.1
N$44
  Top 0.15: R15.2 IC2.4
N$45
  Top 0.61: C21.1 52.97,12.4 L2.1 52.98,12.38 C25.2
N$46
  Top 0.61: C22.1 54.01,13.13 C24.2 54.03,13.11 L4.1
N$47
  Top 0.61: L4.2 54.87,10.79 | 54.87,10.79 C25.1 | L5.1 54.87,10.79
N$48
  Top 0.61: L5.2 56.77,8.09 C32.1 57.38,7.56 L8.1
N$49
  Top 0.61: L8.2 59.63,5.97 ANT1.FP
N$50
  Top 0.15: IC1.15 45.28,17.02 41.97,14.73 35.36,14.73 R14.1
N$51
  Top 0.15: R16.1 C36.2 42.53,17.78 44.7,17.78 45.15,18.1 IC1.13 | R17.2 41.44,17.77
  Top 0.254: 41.44,17.77 R16.1
N$52
  Top 0.15: IC1.12 44.45,18.22 43.56,18.22 43.05,18.73 37.4,18.73 34.29,15.56 34.29,14.97 R18.1
PWM1  (via drill 0.3)
  Top 0.15: IC4.4 v20.89,11.37 | v24.83,15.3 32.13,15.3 R11.1
  Bottom 0.15: v20.89,11.37 v24.83,15.3
PWM2
  Top 0.15: IC6.4 24.4,15.98 31.54,15.98 32.07,16.57 R10.1
RED_LED  (via drill 0.3)
  Top 0.15: IC1.11 44.45,18.86 v44.07,18.86
  Bottom 0.15: v44.07,18.86 45.59,16.95 45.66,16.83 45.66,15.88 46.16,15.37 48.77,15.37 53.15,18.54 53.15,25.91 53.71,26.47 60.13,26.48 60.77,25.84 60.77,24 R45.1
SCL  (via drill 0.3, 0.5 pad 1.02)
  Top 0.15: U$2.P$4 30.76,25.82 30.42,26.16 29.65,26.16 v29.27,26.54 R13.1 | IC1.2 48.32,23.24 v48.32,24.13 46.86,26.73 v46.86,27.43 | U2.4 38.42,25.09 38.16,25.08 v37.66,25.02
  Bottom 0.15: v48.32,24.13 47.88,24.57 38.1,24.57 v37.66,25.02 36.64,26.04 29.78,26.04 v29.27,26.54
SDA  (via drill 0.3, 0.5 pad 1.02)
  Top 0.15: IC1.3 47.69,23.24 v47.69,23.5 v45.59,27.43 | U$2.P$6 v28.83,24.45 28.19,25.02 R12.1 | U2.6 39.7,23.57 v39.18,23.05
  Bottom 0.15: v47.69,23.5 47.05,24.19 40.32,24.19 v39.18,23.05 30.86,23.05 29.4,24.45 v28.83,24.45 28.7,24.57
SPI_MO  (via drill 0.3)
  Top 0.15: R14.2 24.72,12.87 v24.7,12.89
  Top 0.305: IC2.2 14.32,4.73 v14.35,4.76
  Bottom 0.15: v24.7,12.89 21.02,9.21 15.88,9.21 14.35,7.68 v14.35,4.76
SW1  (via drill 0.3)
  Top 0.15: IC1.19 40.89,11.62 40.89,6.35 38.67,4.13 v32.38,4.13
  Bottom 0.15: v32.38,4.13 S1.2
SW2  (via drill 0.3)  (1 unrouted)
  Top 0.15: IC1.18 46.8,16.26 v46.42,16.13
  Bottom 0.15: v46.42,16.13 46.8,15.75 48.58,15.75 52.77,18.8 52.77,26.16 53.53,26.92 62.17,26.92
VBAT  (via drill 0.3)
  Top 0.15: 2.73,17.59 13.59,17.59 16,20 16,24.51 17.53,26.04 22.73,26.04 29.92,18.85 34.72,18.85 v35.88,20 | v38.1,17.78 39.13,17.78
  Top 0.254: 2.73,17.59 v1.08,15.94 | 39.13,17.78 R17.1
  Bottom 0.15: v35.88,20 v38.1,17.78
  other vias: 1.08,14.16 1.08,15.05 1.08,16.83 1.08,13.27
  pour Top (isolate 0.254, no thermals): 10.1,22.99 10.1,22.35 9.53,21.78 8.06,21.78 7.24,20.7 7.24,18.29 9.27,16.51 9.27,14.54 3.56,14.54 3.05,14.03 3.05,12.32 3.62,11.81 6.29,11.81 6.29,11.43 0.19,11.43 0.25,18.61 3.05,18.61 7.43,22.99
VBUS  (via drill 0.3)
  Bottom 0.15: v2.98,26.23 1.52,26.23 1.52,26.21 LED1.A
  pour Top (isolate 0.254, no thermals): 10.1,25.65 6.1,25.65 5.78,25.97 2.73,25.97 2.73,26.42 9.84,26.42 10.1,26.16
VDD  (via drill 0.3)
  Top 0.305: IC1.31 53.84,19.94 C15.2 54.05,19.98 54.05,20.14 53.96,20.67 v53.89,20.89 | IC1.39 51.57,23.23 C14.2 51.6,23.27 v51.65,22.53 | IC1.10 45,20.97 C13.2 44.31,21.01 v43.73,21.9 | IC1.24 50.58,15.61 50.34,14.22 v50.52,13.96 50.57,13.89 C17.2 | IC1.21 48.94,15.34 v48.75,14.28 48.67,13.83 C16.2 | U2.14 40.7,28 C38.1 40.2,28 U2.15 | U2.1 C40.1 37.78,26.61 v36.89,26.61 | U$2.P$1 32.26,25.73 C33.2 33.2,26.8 v33.21,27.5 | L6.1 36.03,22 v36.7,22.04 | v30.16,28.57 29.29,28.57 R13.2 | v28.07,27.24 R12.2 | U$1.P2 10.58,20.78 C20.1 10.87,19.7 R22.2
  Top 0.6: C38.1 C39.1 v39.56,29.15
  Bottom 0.406: X4.2 59.67,28.46 v60.54,28.46
  other vias: 55.4,18.35 10.22,19.81 10.86,19.81 10.22,19.18 10.86,19.18
  pour Top (isolate 0.254, no thermals): 51.83,18.18 52.29,17.53 53.17,17.37 54.99,18.65 55.66,18.53 55.84,18.27 55.8,18.05 53.07,16.14 51.96,16.33 51.05,17.63
  pour Route15 (isolate 0.254, rank 2, no thermals): 55.05,29.59 64.83,29.78 64.8,6.29 42.16,6.35 42.1,0.06 -0.03,-0.06 0.25,29.78
  pour Top (isolate 0.254, no thermals): 10.48,22.23 10.48,22.1 9.97,21.59 9.97,18.92 11.11,18.92 11.11,21.59
WS2812B_OUT
  Top 0.15: U$7.3 8.51,2.15 R15.1